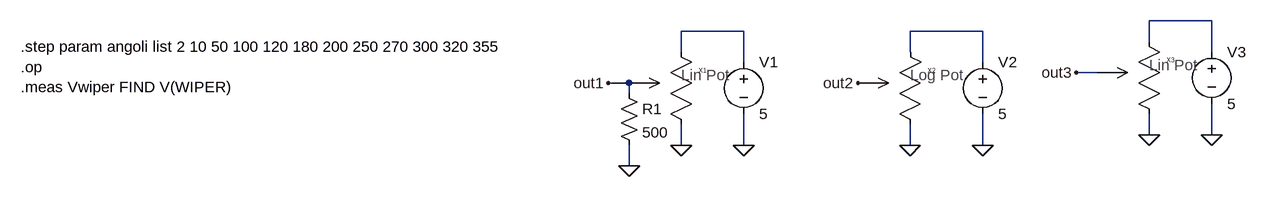
[diagram p0: schematic implementation.asc]
implementation.asc, the LTspice schematic file:
Version 4
SHEET 1 1232 680
WIRE 912 80 816 80
WIRE 192 96 96 96
WIRE 560 96 448 96
WIRE 816 112 816 80
WIRE 96 128 96 96
WIRE 448 128 448 96
WIRE 912 128 912 80
WIRE 192 144 192 96
WIRE 560 144 560 96
WIRE 736 160 704 160
WIRE 16 176 -16 176
WIRE 16 192 16 176
WIRE 816 256 816 224
WIRE 912 256 912 208
WIRE 96 272 96 240
WIRE 192 272 192 224
WIRE 448 272 448 240
WIRE 560 272 560 224
WIRE 16 304 16 272
FLAG 96 272 0
FLAG 192 272 0
FLAG 448 272 0
FLAG 560 272 0
FLAG -16 176 out1
FLAG 368 176 out2
FLAG 16 304 0
FLAG 816 256 0
FLAG 912 256 0
FLAG 704 160 out3
SYMBOL voltage 192 128 R0
WINDOW 123 0 0 Left 0
WINDOW 39 0 0 Left 0
SYMATTR InstName V1
SYMATTR Value 5
SYMBOL voltage 560 128 R0
WINDOW 123 0 0 Left 0
WINDOW 39 0 0 Left 0
SYMATTR InstName V2
SYMATTR Value 5
SYMBOL pot_log 432 144 R0
SYMATTR InstName X2
SYMATTR SpiceLine R=10k ang={angoli} b=10
SYMBOL pot 80 144 R0
SYMATTR InstName X1
SYMATTR SpiceLine R=10k ang={angoli}
SYMBOL res 0 176 R0
SYMATTR InstName R1
SYMATTR Value 500
SYMBOL voltage 912 112 R0
WINDOW 123 0 0 Left 0
WINDOW 39 0 0 Left 0
SYMATTR InstName V3
SYMATTR Value 5
SYMBOL pot 800 128 R0
SYMATTR InstName X3
SYMATTR SpiceLine R=10k ang={angoli}
TEXT -920 120 Left 2 !.step param angoli list 2 10 50 100 120 180 200 250 270 300 320 355\n.op\n.meas Vwiper FIND V(WIPER)

The netlist it stands for:
* implementation.asc
V1 N002 0 5
V2 N003 0 5
XX2 N003 out2 0 pot_log R=10k ang={angoli} b=10  ; pins 1 2 3
XX1 N002 out1 0 pot R=10k ang={angoli}  ; pins 1 2 3
R1 out1 0 500
V3 N001 0 5
XX3 N001 out3 0 pot R=10k ang={angoli}  ; pins 1 2 3
.step param angoli list 2 10 50 100 120 180 200 250 270 300 320 355
.op
.meas Vwiper FIND V(WIPER)
.backanno
.end